# EAGLE design Circuit (EAGLE 6.3)
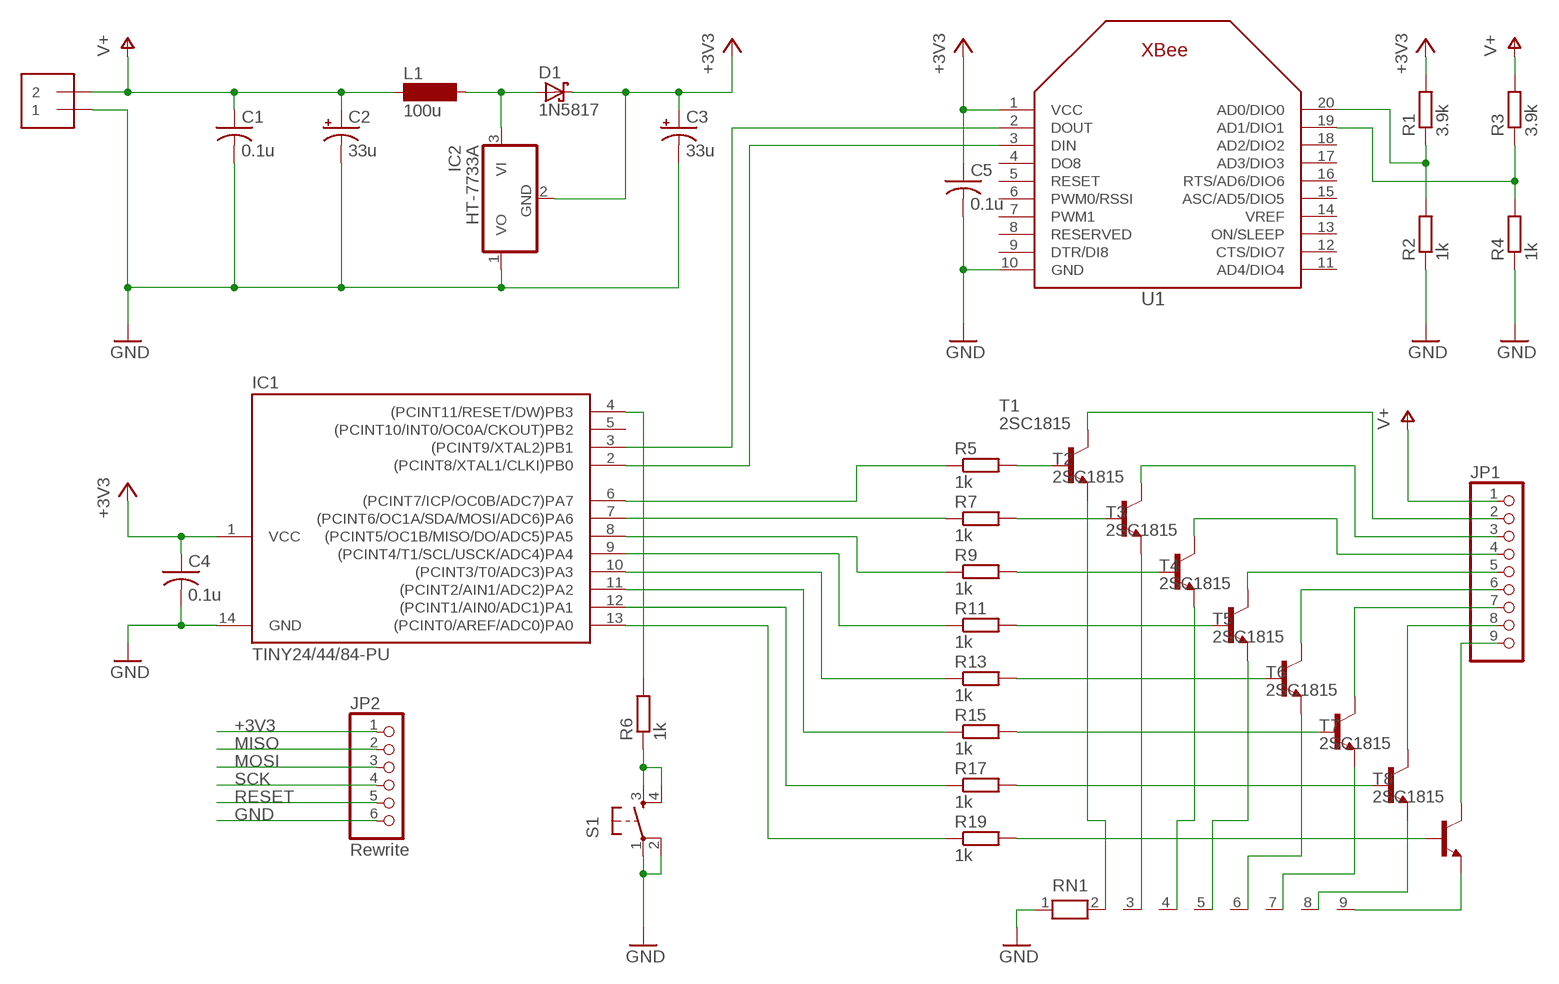
[diagram p0: schematic, sheet 1]

## Parts
C1  0.1u  C-US050-025X075  [C050-025X075]
C2  33u  CPOL-USE2.5-6  [E2,5-6]
C3  33u  CPOL-USE2.5-6  [E2,5-6]
C4  0.1u  C-US050-025X075  [C050-025X075]
C5  0.1u  C-US050-025X075  [C050-025X075]
D1  1N5817  SCHOTTKY-DIODEDO41-7  [DO41-7]
IC1  TINY24/44/84-PU  [DIL14]
IC2  HT-7733A  78L05Z  [TO92]
J1  1X2-3.5MM  [1X2-3.5MM]
JP1  PINHD-1X9  [1X09-BIG]
JP2  Rewrite  PINHD-1X6  [1X06]
L1  100u  BS11  [BS11]
R1  3.9k  R-EU_0204/7  [0204/7]
R2  1k  R-EU_0204/7  [0204/7]
R3  3.9k  R-EU_0204/7  [0204/7]
R4  1k  R-EU_0204/7  [0204/7]
R5  1k  R-EU_0204/7  [0204/7]
R6  1k  R-EU_0204/7  [0204/7]
R7  1k  R-EU_0204/7  [0204/7]
R9  1k  R-EU_0204/7  [0204/7]
R11  1k  R-EU_0204/7  [0204/7]
R13  1k  R-EU_0204/7  [0204/7]
R15  1k  R-EU_0204/7  [0204/7]
R17  1k  R-EU_0204/7  [0204/7]
R19  1k  R-EU_0204/7  [0204/7]
RN1  RN08  [RN-9]
S1  TAC_SWITCHPTH  [TACTILE-PTH]
T1  2SC1815  [TO92-ECB]
T2  2SC1815  [TO92-ECB]
T3  2SC1815  [TO92-ECB]
T4  2SC1815  [TO92-ECB]
T5  2SC1815  [TO92-ECB]
T6  2SC1815  [TO92-ECB]
T7  2SC1815  [TO92-ECB]
T8  2SC1815  [TO92-ECB]
U1  XBEE  [XBEE]

## Nets
+3V3: C3.+ C4.1 C5.1 D1.C IC1.1(VCC) IC2.2(GND) JP2.1 R1.2 U1.1(VCC)
GND: C1.2 C2.- C3.- C4.2 C5.2 IC1.14(GND) IC2.1(VO) J1.1 JP2.6 R2.1 R4.1 RN1.1 S1.1 S1.2 U1.10(GND)
MISO: IC1.8((PCINT5/OC1B/MISO/DO/ADC5)PA5) JP2.2 R9.1
MOSI: IC1.7((PCINT6/OC1A/SDA/MOSI/ADC6)PA6) JP2.3 R7.1
N$1: IC1.3((PCINT9/XTAL2)PB1) U1.2(DOUT)
N$2: IC1.2((PCINT8/XTAL1/CLKI)PB0) U1.3(DIN)
N$3: D1.A IC2.3(VI) L1.2
N$4: R6.1 S1.3 S1.4
N$6: R5.2 T1.B
N$7: JP1.2 T1.C
N$8: R1.1 R2.2 U1.20(AD0/DIO0)
N$9: R3.1 R4.2 U1.19(AD1/DIO1)
N$11: R7.2 T2.B
N$12: JP1.3 T2.C
N$13: IC1.6((PCINT7/ICP/OC0B/ADC7)PA7) R5.1
N$14: R9.2 T3.B
N$15: JP1.4 T3.C
N$16: RN1.8 T7.E
N$17: R11.2 T4.B
N$18: JP1.5 T4.C
N$20: R13.2 T5.B
N$21: JP1.6 T5.C
N$23: R15.2 T6.B
N$24: JP1.7 T6.C
N$25: IC1.10((PCINT3/T0/ADC3)PA3) R13.1
N$26: R17.2 T7.B
N$27: JP1.8 T7.C
N$28: IC1.11((PCINT2/AIN1/ADC2)PA2) R15.1
N$29: R19.2 T8.B
N$30: JP1.9 T8.C
N$31: IC1.12((PCINT1/AIN0/ADC1)PA1) R17.1
N$32: RN1.3 T2.E
N$33: RN1.4 T3.E
N$34: RN1.5 T4.E
N$35: RN1.6 T5.E
N$36: RN1.7 T6.E
N$37: RN1.9 T8.E
N$38: RN1.2 T1.E
N$44: IC1.13((PCINT0/AREF/ADC0)PA0) R19.1
RESET: IC1.4((PCINT11/RESET/DW)PB3) JP2.5 R6.2
SCK: IC1.9((PCINT4/T1/SCL/USCK/ADC4)PA4) JP2.4 R11.1
V+: C1.1 C2.+ J1.2 JP1.1 L1.1 R3.2
Unconnected: IC1.5((PCINT10/INT0/OC0A/CKOUT)PB2) U1.4(DO8) U1.5(RESET) U1.6(PWM0/RSSI) U1.7(PWM1) U1.8(RESERVED) U1.9(DTR/DI8) U1.11(AD4/DIO4) U1.12(CTS/DIO7) U1.13(ON/SLEEP) U1.14(VREF) U1.15(ASC/AD5/DIO5) U1.16(RTS/AD6/DIO6) U1.17(AD3/DIO3) U1.18(AD2/DIO2)

## Library data of the parts
C1 C4 C5 = adafruit:C-US: CAPACITOR, American symbol
C2 C3 = adafruit:CPOL-US: POLARIZED CAPACITOR, American symbol
D1 = adafruit:SCHOTTKY-DIODE: Schottky Diode
IC1 = avr-7:TINY24/44/84
IC2 = adafruit:78*: Positive VOLTAGE REGULATOR Added bigger pads to the TO-92 package
J1 = adafruit:1X2: 3.5mm Terminal block http://www.ladyada.net/library/pcb/eaglelibrary.html
JP1 = adafruit:PINHD-1X9: Pin header 1x10 0.1" spacing With round pins
JP2 = adafruit:PINHD-1X6: PIN HEADER
L1 = inductor-neosid:BS: INDUCTOR nominal inductance, magnetically screened; OC_FARNELL: unknown; OC_NEWARK: unknown
R1-R7 R9 R11 R13 R15 R17 R19 = rcl:R-EU_: RESISTOR, European symbol
RN1 = resistor-net:RN08: RESISTOR NETWORK; OC_FARNELL: unknown; OC_NEWARK: unknown
S1 = SparkFun:TAC_SWITCH: Momentary Switch Button commonly used for reset or general input. Spark Fun Electronics SKU : COM-00097
T1-T8 = transistor:2SC1815: NPN EPITAXIAL TRANSISTOR Source: TOSHIBA .. 2SC1815 1.pdf
U1 = adafruit:XBEE

## Board
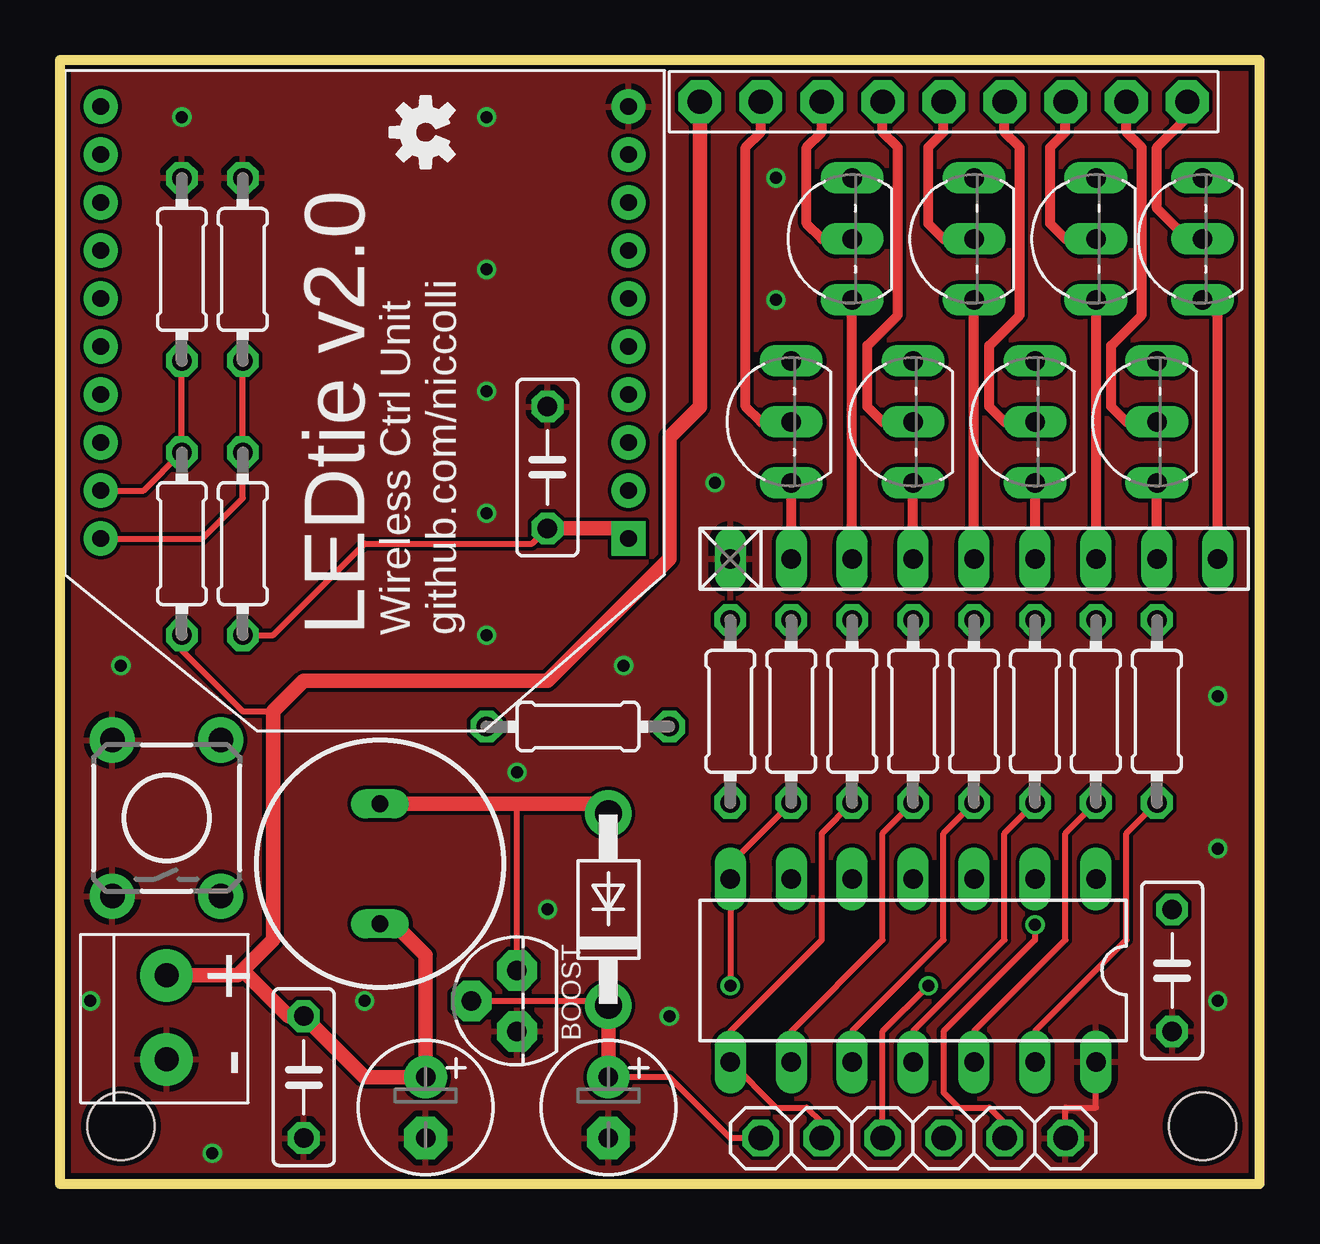
[diagram p1: board, top side]
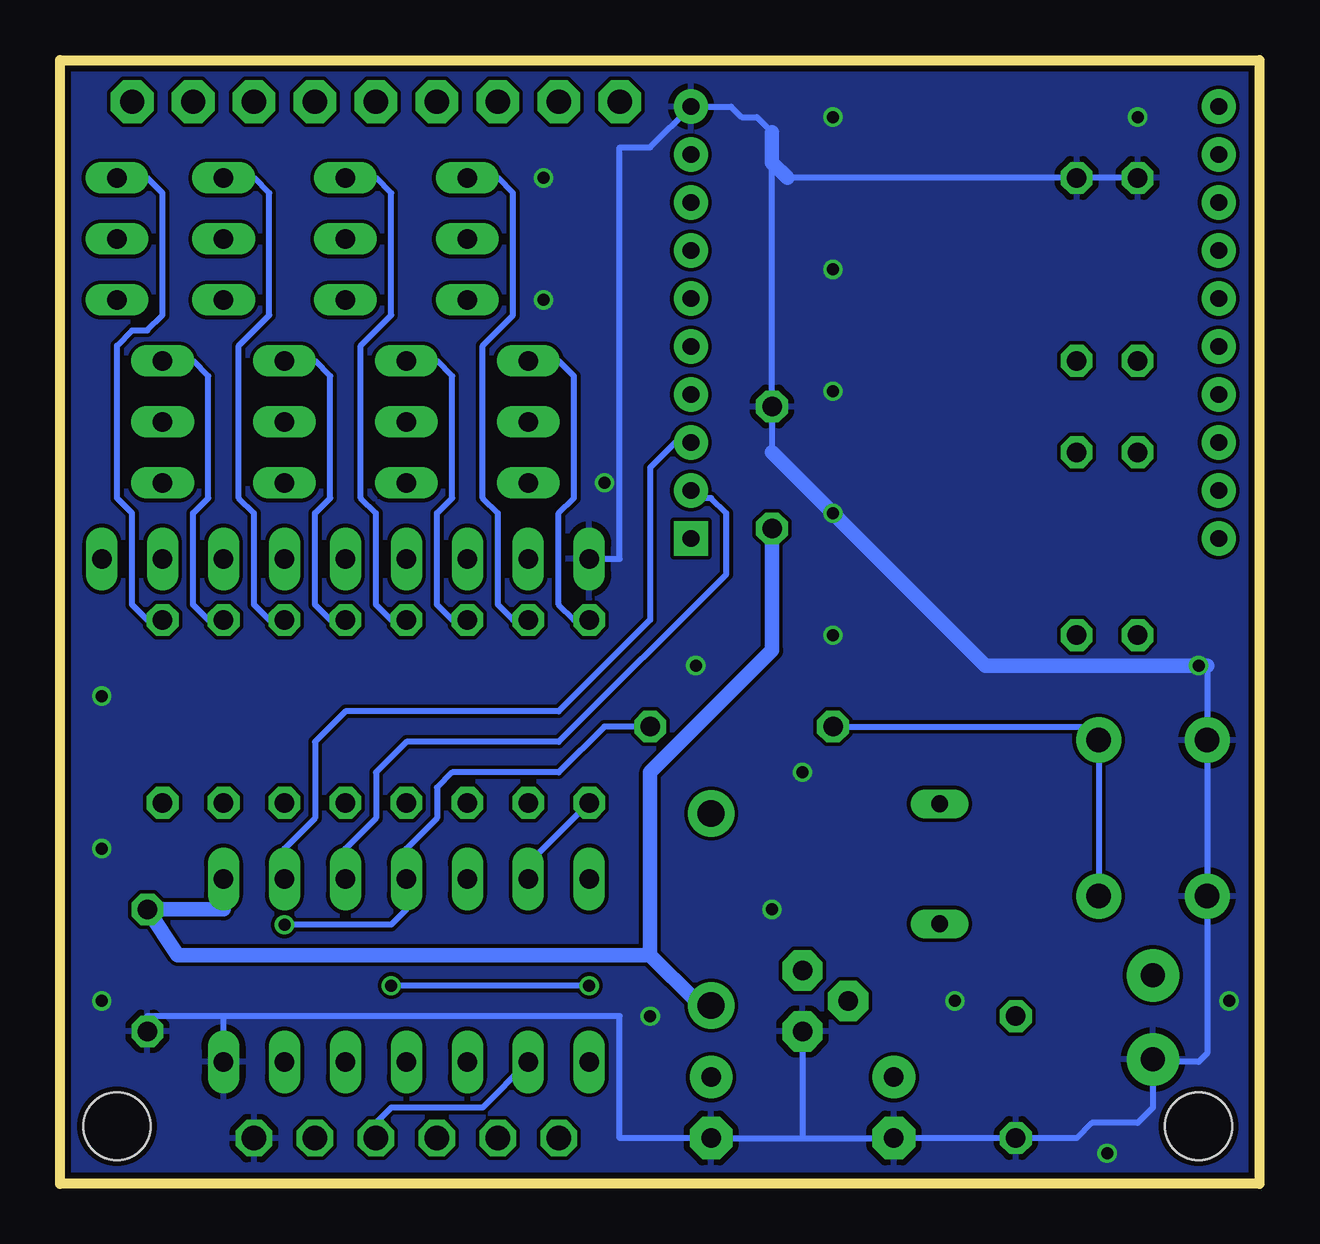
[diagram p2: board, bottom side, seen from below]

Size 50 x 46.83 mm. Coordinates in mm from the lower left corner, seen from the top.
Outline: 0,0 0,46.83 50,46.83 50,0 0,0
Copper layers (1*16): Top 0.035mm / dielectric 1.5mm / Bottom 0.035mm
Design rules "Fusion_eagle_rule_v1.1": minimum track width 6mil, minimum drill 12mil, track to track 6mil, track to pad 6mil, pad to pad 6mil, via to via 6mil, smd to smd 0mil, copper to edge 10mil, drill to drill 10mil, minimum pad ring 10mil, minimum via ring 6mil, stop-mask expansion 2mil, vias tented up to drill 100mil, thermal gap 10mil
Holes 2.8 mm at 47.62,2.4 2.54,2.4

### Footprints (pad centres in the part's own frame; a part is rotated, then mirrored left to right if it is on the bottom)
C050-025X075 = drill 0.813 octagon: 1 -2.54,0; 2 2.54,0
E2,5-6 = drill 0.813 pad 1.778: + -1.27,0 | drill 0.813 pad 1.778 octagon: - 1.27,0
DO41-7 = drill 1.118 pad 1.93: A 4,0; C -4,0
DIL14 = drill 0.813 long: 1 -7.62,-3.81; 2 -5.08,-3.81; 3 -2.54,-3.81; 4 0,-3.81; 5 2.54,-3.81; 6 5.08,-3.81; 7 7.62,-3.81; 8 7.62,3.81; 9 5.08,3.81; 10 2.54,3.81; 11 0,3.81; 12 -2.54,3.81; 13 -5.08,3.81; 14 -7.62,3.81
TO92 = drill 0.813 pad 1.676 octagon: 1 -1.27,0; 2 0,1.905; 3 1.27,0
1X2-3.5MM = drill 1 pad 2.184: 1 1.8,0; 2 -1.7,0
1X09-BIG = drill 1.016 pad 1.778 octagon: 1 -10.16,0; 2 -7.62,0; 3 -5.08,0; 4 -2.54,0; 5 0,0; 6 2.54,0; 7 5.08,0; 8 7.62,0; 9 10.16,0
1X06 = drill 1.016 octagon: 1 -6.35,0; 2 -3.81,0; 3 -1.27,0; 4 1.27,0; 5 3.81,0; 6 6.35,0
BS11 = drill 0.7 long: 1 -2.5,0; 2 2.5,0
0204/7 = drill 0.813 octagon: 1 -3.81,0; 2 3.81,0
RN-9 = drill 0.813 long: 1 -10.16,0; 2 -7.62,0; 3 -5.08,0; 4 -2.54,0; 5 0,0; 6 2.54,0; 7 5.08,0; 8 7.62,0; 9 10.16,0
TACTILE-PTH = drill 1.016 pad 1.88: 1 -3.251,2.261; 2 3.251,2.261; 3 -3.251,-2.261; 4 3.251,-2.261
TO92-ECB = drill 0.813 long: B 2.54,0; C 0,0; E -2.54,0
XBEE = drill 0.7 pad 1.422 square: 1 -11,5.5 | drill 0.7 pad 1.422: 2 -11,3.5; 3 -11,1.5; 4 -11,-0.5; 5 -11,-2.5; 6 -11,-4.5; 7 -11,-6.5; 8 -11,-8.5; 9 -11,-10.5; 10 -11,-12.5; 11 11,-12.5; 12 11,-10.5; 13 11,-8.5; 14 11,-6.5; 15 11,-4.5; 16 11,-2.5; 17 11,-0.5; 18 11,1.5; 19 11,3.5; 20 11,5.5

### Placement (x,y rotation side)
C1  10.16,4.45 270 top
C2  15.24,3.17 270 top
C3  22.86,3.17 270 top
C4  46.35,8.89 270 top
C5  20.32,29.84 90 top
D1  22.86,11.43 90 top
IC1  35.56,8.89 180 top
IC2  19.05,7.62 90 top
J1  4.45,6.99 270 top
JP1  36.83,45.09 0 top
JP2  35.56,1.91 0 top
L1  13.34,13.34 90 top
R1  7.62,26.67 270 top
R2  7.62,38.1 270 top
R3  5.08,26.67 270 top
R4  5.08,38.1 270 top
R5  27.94,19.68 90 top
R6  21.59,19.05 0 top
R7  30.48,19.68 90 top
R9  33.02,19.68 90 top
R11  35.56,19.68 90 top
R13  38.1,19.68 90 top
R15  40.64,19.68 90 top
R17  43.18,19.68 90 top
R19  45.72,19.68 90 top
RN1  38.1,26.04 0 top
S1  4.45,15.24 90 top
T1  30.48,31.75 90 top
T2  33.02,39.37 90 top
T3  35.56,31.75 90 top
T4  38.1,39.37 90 top
T5  40.64,31.75 90 top
T6  43.18,39.37 90 top
T7  45.72,31.75 90 top
T8  47.62,39.37 90 top
U1  12.7,32.38 180 top
U$1  [OSHW-LOGO-S]  15.24,43.81 90 top

### Tracks (layer width: path | path; a pad name or v marks a point on that pad's centre or on a via)
+3V3
  Top 0.254: IC2.2 22.67,7.62 D1.C | R1.2 8.89,22.86 12.7,26.67 19.68,26.67 C5.1 | JP2.1 27.94,1.91 25.4,4.45 C3.+
  Top 0.61: D1.C C3.+ | C5.1 23.28,27.3 U1.1
  Bottom 0.61: IC1.1 43.18,11.43 C4.1 45.09,9.53 25.4,9.53 | 25.4,9.53 23.5,7.62 23.05,7.62 D1.C | 25.4,9.53 25.4,17.14 20.32,22.23 C5.1
GND  (via drill 0.5)
  Top 0.254: JP2.6 41.91,3.17 43.18,3.17 IC1.14
  Bottom 0.254: 19.05,1.91 C3.- 26.67,1.91 26.67,6.99 43.18,6.99 | 19.05,1.91 C2.- C1.2 7.62,1.91 6.99,2.54 5.08,2.54 4.45,3.17 4.45,5.08 | IC2.1 19.05,1.91 | 20.32,42.55 C5.2 20.32,30.48 | R4.1 R2.1 19.68,41.91 | 2.18,21.59 S1.2 S1.1 2.18,5.44 2.54,5.08 4.34,5.08 J1.1 | 20.32,43.81 20.95,44.45 21.59,44.45 22.02,44.88 U1.10 25.4,43.18 26.67,43.18 26.67,26.04 RN1.1 | IC1.14 43.18,6.99 | 43.18,6.99 46.35,6.99 C4.2
  Bottom 0.61: 20.32,43.81 20.32,42.55 19.68,41.91 | 20.32,30.48 v17.78,27.94 11.43,21.59 v2.54,21.59 2.18,21.59
  other vias: 48.26,7.62 48.26,13.97 20.32,11.43 12.7,7.62 6.35,1.27 1.27,7.62 25.4,6.99 19.05,17.14 23.5,21.59 17.78,22.86 17.78,33.02 17.78,38.1 17.78,44.45 5.08,44.45 48.26,20.32 29.84,41.91 29.84,36.83 27.3,29.21
  pour Bottom: -1.27,48.26 50.8,48.26 50.8,-1.27 -1.27,-1.27
  pour Top: -1.27,-1.27 50.8,-1.27 50.8,48.26 -1.27,48.26
MISO
  Top 0.254: R9.1 31.75,14.61 31.75,10.16 27.94,6.35 IC1.8 29.84,3.17 31.11,3.17 31.75,2.54 JP2.2
MOSI  (via drill 0.5, 0.5 pad 0.25)
  Top 0.254: R7.1 27.94,13.34 IC1.7 v27.94,8.26 | JP2.3 34.29,6.35 v36.2,8.26
  Bottom 0.254: v27.94,8.26 v36.2,8.26
N$1
  Bottom 0.254: IC1.3 38.1,13.97 36.83,15.24 36.83,17.14 35.56,18.41 29.21,18.41 22.23,25.4 22.23,27.94 22.86,28.57 23.39,28.57 U1.2
N$2
  Bottom 0.254: U1.3 24.36,30.89 25.4,29.84 25.4,23.5 29.21,19.68 38.1,19.68 39.37,18.41 39.37,15.24 40.64,13.97 IC1.2
N$3
  Top 0.254: IC2.3 19.05,15.84
  Top 0.61: L1.2 19.05,15.84 22.45,15.84 D1.A
N$4
  Bottom 0.254: R6.1 7.26,19.05 S1.4 S1.3
N$6
  Bottom 0.254: R5.2 28.57,23.5 29.21,24.13 29.21,27.94 28.57,28.57 28.57,33.66 29.21,34.29 T1.B
N$7
  Top 0.406: T1.C 29.21,31.75 28.57,32.38 28.57,43.18 29.21,43.81 JP1.2
N$8
  Top 0.254: R2.2 R1.1 7.62,28.57 5.93,26.89 U1.20
N$9
  Top 0.254: R4.2 R3.1 3.48,28.89 U1.19
N$11
  Bottom 0.254: R7.2 31.11,23.5 31.75,24.13 31.75,27.94 32.38,28.57 32.38,34.92 31.11,36.2 31.11,41.27 31.75,41.91 T2.B
N$12
  Top 0.406: T2.C 31.75,39.37 31.11,40.01 31.11,43.18 31.75,43.81 JP1.3
N$13
  Bottom 0.254: R5.1 30.48,13.34 IC1.6
N$14
  Bottom 0.254: R9.2 33.66,23.5 34.29,24.13 34.29,27.94 33.66,28.57 33.66,33.66 34.29,34.29 T3.B
N$15
  Top 0.406: T3.C 34.29,31.75 33.66,32.38 33.66,34.92 34.92,36.2 34.92,43.18 34.29,43.81 JP1.4
N$16
  Top 0.406: RN1.8 T7.E
N$17
  Bottom 0.254: R11.2 36.2,23.5 36.83,24.13 36.83,27.94 37.47,28.57 37.47,34.92 36.2,36.2 36.2,41.27 36.83,41.91 T4.B
N$18
  Top 0.406: T4.C 36.83,39.37 36.2,40.01 36.2,43.18 36.83,43.81 JP1.5
N$20
  Bottom 0.254: R13.2 38.73,23.5 39.37,24.13 39.37,27.94 38.73,28.57 38.73,33.66 39.37,34.29 T5.B
N$21
  Top 0.406: T5.C 39.37,31.75 38.73,32.38 38.73,34.92 40.01,36.2 40.01,43.18 39.37,43.81 JP1.6
N$23
  Bottom 0.254: R15.2 41.27,23.5 41.91,24.13 41.91,27.94 42.55,28.57 42.55,34.92 41.27,36.2 41.27,41.27 41.91,41.91 T6.B
N$24
  Top 0.406: T6.C 41.91,39.37 41.27,40.01 41.27,43.18 41.91,43.81 JP1.7
N$25
  Top 0.254: IC1.10 33.02,6.35 36.83,10.16 36.83,14.61 R13.1
N$26
  Bottom 0.254: R17.2 43.81,23.5 44.45,24.13 44.45,27.94 43.81,28.57 43.81,33.66 44.45,34.29 T7.B
N$27
  Top 0.406: T7.C 44.45,31.75 43.81,32.38 43.81,34.92 45.09,36.2 45.09,43.18 44.45,43.81 JP1.8
N$28
  Top 0.254: IC1.11 35.56,6.35 39.37,10.16 39.37,14.61 R15.1
N$29
  Bottom 0.254: R19.2 46.35,23.5 46.99,24.13 46.99,27.94 47.62,28.57 47.62,34.92 46.99,35.56 46.35,35.56 45.72,36.2 45.72,41.27 46.35,41.91 T8.B
N$30
  Top 0.406: T8.C 46.99,39.37 45.72,40.64 45.72,43.18 46.99,44.45 JP1.9
N$31
  Top 0.254: IC1.12 38.1,6.35 41.91,10.16 41.91,14.61 R17.1
N$32
  Top 0.406: RN1.3 T2.E
N$33
  Top 0.406: RN1.4 T3.E
N$34
  Top 0.406: RN1.5 T4.E
N$35
  Top 0.406: T5.E RN1.6
N$36
  Top 0.406: T6.E RN1.7
N$37
  Top 0.406: RN1.9 48.26,36.2 T8.E
N$38
  Top 0.406: RN1.2 T1.E
N$44
  Top 0.254: IC1.13 40.64,6.35 44.45,10.16 44.45,14.61 R19.1
RESET  (via drill 0.5)
  Top 0.254: v40.64,10.79 40.64,10.16 36.83,6.35 36.83,3.81 37.47,3.17 38.73,3.17 39.37,2.54 JP2.5
  Bottom 0.254: R6.2 27.3,19.05 29.21,17.14 33.66,17.14 34.29,16.51 34.29,15.24 35.56,13.97 IC1.4 35.56,11.43 36.2,10.79 v40.64,10.79
SCK
  Top 0.254: IC1.9 30.48,6.35 34.29,10.16 34.29,14.61 R11.1
  Bottom 0.254: IC1.9 32.38,3.17 36.2,3.17 36.83,2.54 JP2.4
V+
  Top 0.254: R3.2 5.08,22.23 7.62,19.68 8.89,19.68
  Top 0.61: L1.1 13.38,10.79 13.97,10.79 15.24,9.53 C2.+ 12.7,4.45 C1.1 9.53,6.99 7.62,8.89 | 7.62,8.89 7.42,8.69 J1.2 | 7.62,8.89 8.89,10.16 8.89,19.68 10.16,20.95 20.32,20.95 25.4,26.04 25.4,31.11 26.67,32.38 JP1.1

### Text on the board
tNames: LEDtie v2.0 | Wireless Ctrl Unit / github.com/niccolli | + | BOOST | -